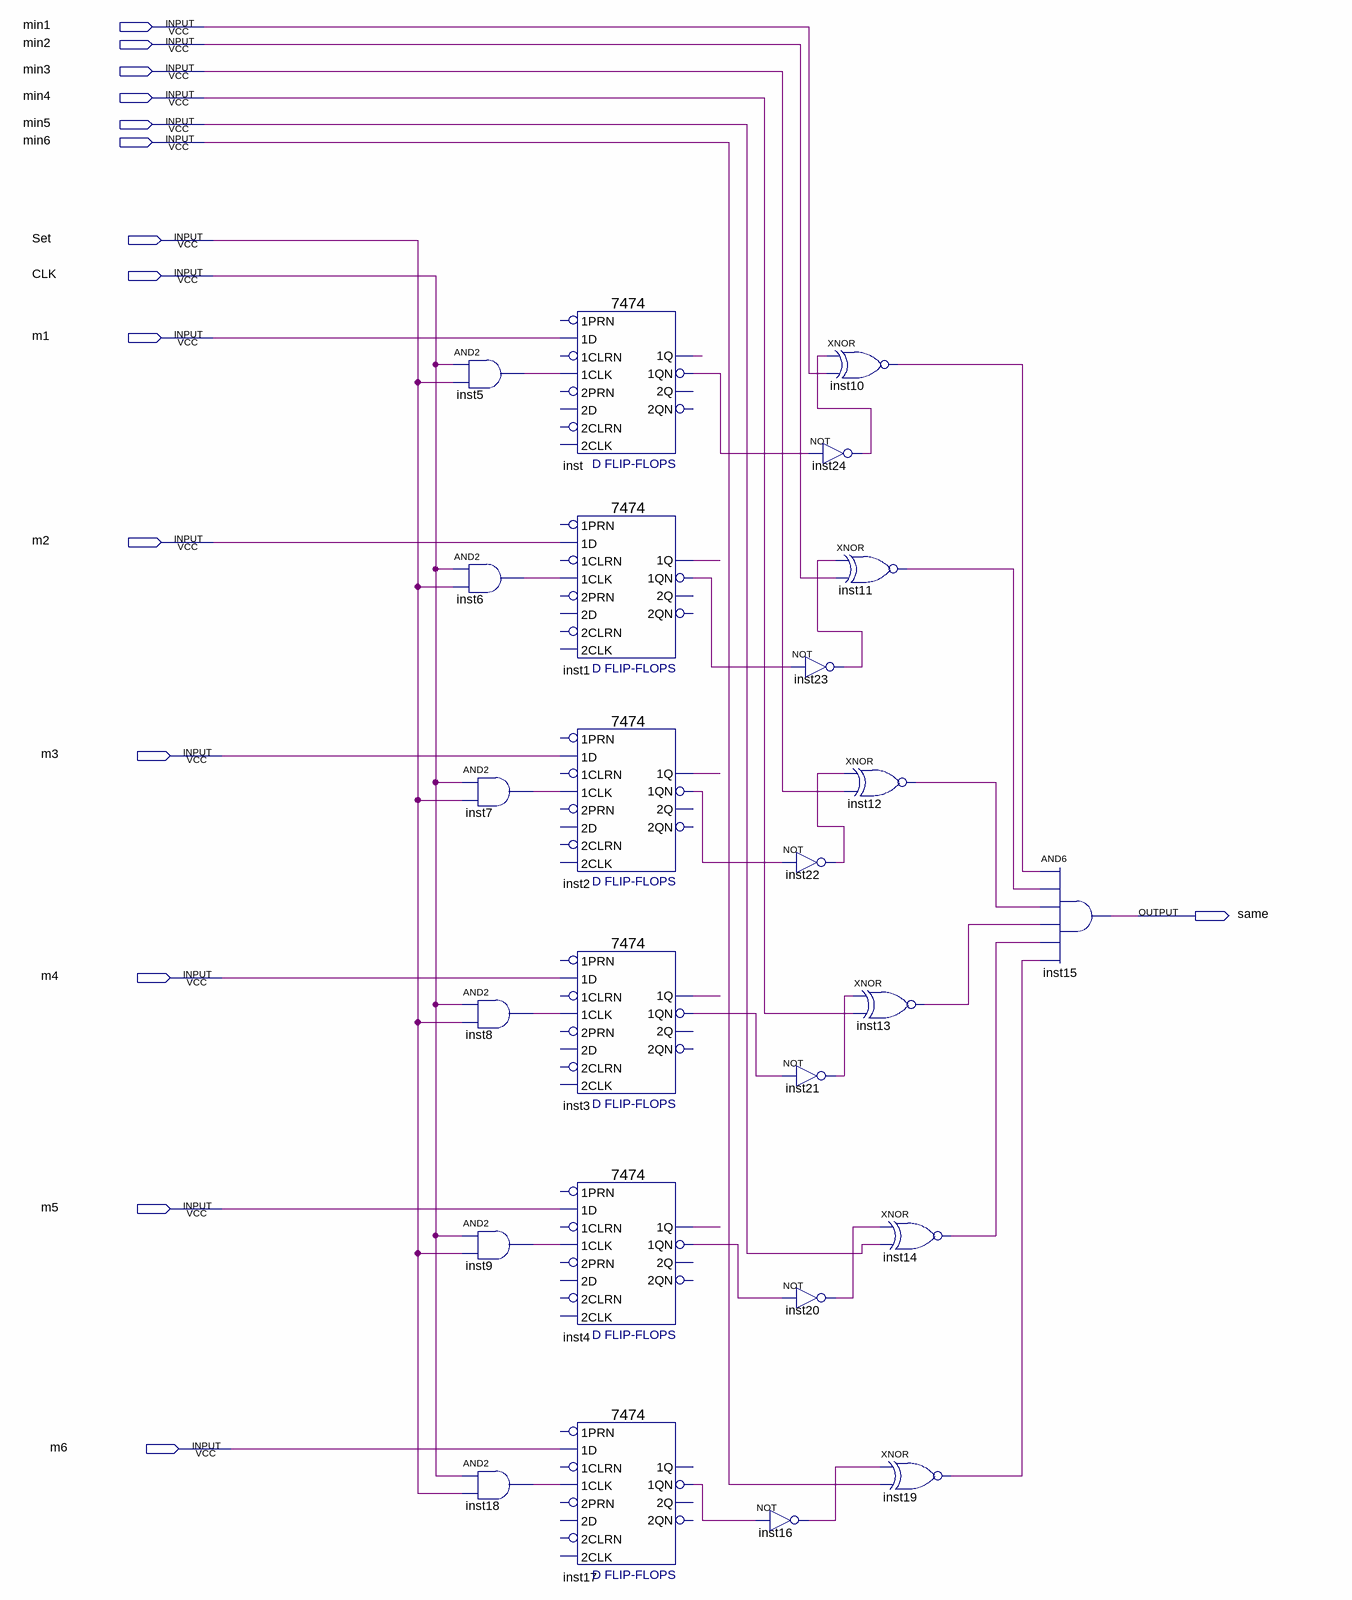
[diagram p0: schematic sheet]
// Quartus schematic same.bdf as structural Verilog: 25 symbols, 15 pins
module same (
  input  min1,
  input  min2,
  input  min3,
  input  min4,
  input  min5,
  input  min6,
  input  Set,
  input  CLK,
  input  m1,
  input  m2,
  input  m3,
  input  m4,
  input  m5,
  input  m6,
  output same
);

  wire inst1_1q, inst1_1qn, inst2_1q, inst2_1qn, inst3_1q, inst3_1qn, inst4_1q, inst4_1qn, inst5_out,
       inst6_out, inst7_out, inst8_out, inst9_out, inst10_out, inst11_out, inst12_out, inst13_out,
       inst14_out, inst16_out, inst17_1qn, inst18_out, inst19_out, inst20_out, inst21_out, inst22_out,
       inst23_out, inst24_out, inst_1q, inst_1qn;

  and inst5 (inst5_out, CLK, Set);
  and inst6 (inst6_out, CLK, Set);
  and inst7 (inst7_out, CLK, Set);
  and inst8 (inst8_out, CLK, Set);
  and inst9 (inst9_out, CLK, Set);
  and inst18 (inst18_out, CLK, Set);
  \7474  inst (
    .\1CLK (inst5_out), .\1D (m1), .\1QN (inst_1qn), .\1Q (inst_1q));  // open: 2D, 2PRN, 1PRN, 2CLK, 2CLRN, 1CLRN, 2Q, 2QN
  \7474  inst1 (
    .\1CLK (inst6_out), .\1D (m2), .\1QN (inst1_1qn), .\1Q (inst1_1q));  // open: 2D, 2PRN, 1PRN, 2CLK, 2CLRN, 1CLRN, 2Q, 2QN
  \7474  inst2 (
    .\1CLK (inst7_out), .\1D (m3), .\1QN (inst2_1qn), .\1Q (inst2_1q));  // open: 2D, 2PRN, 1PRN, 2CLK, 2CLRN, 1CLRN, 2Q, 2QN
  \7474  inst3 (
    .\1CLK (inst8_out), .\1D (m4), .\1QN (inst3_1qn), .\1Q (inst3_1q));  // open: 2D, 2PRN, 1PRN, 2CLK, 2CLRN, 1CLRN, 2Q, 2QN
  \7474  inst4 (
    .\1CLK (inst9_out), .\1D (m5), .\1QN (inst4_1qn), .\1Q (inst4_1q));  // open: 2D, 2PRN, 1PRN, 2CLK, 2CLRN, 1CLRN, 2Q, 2QN
  \7474  inst17 (
    .\1CLK (inst18_out), .\1D (m6), .\1QN (inst17_1qn));  // open: 2D, 2PRN, 1PRN, 2CLK, 2CLRN, 1CLRN, 2Q, 2QN, 1Q
  not inst16 (inst16_out, inst17_1qn);
  xnor inst10 (inst10_out, inst24_out, min1);
  not inst24 (inst24_out, inst_1qn);
  xnor inst11 (inst11_out, inst23_out, min2);
  not inst23 (inst23_out, inst1_1qn);
  not inst22 (inst22_out, inst2_1qn);
  not inst21 (inst21_out, inst3_1qn);
  not inst20 (inst20_out, inst4_1qn);
  xnor inst12 (inst12_out, inst22_out, min3);
  xnor inst13 (inst13_out, inst21_out, min4);
  xnor inst14 (inst14_out, inst20_out, min5);
  xnor inst19 (inst19_out, inst16_out, min6);
  and inst15 (same, inst10_out, inst11_out, inst12_out, inst13_out, inst14_out, inst19_out);
endmodule
